# EasyEDA Pro project 作业3.eprj

# Schematic Schematic1
Board Name: Board1; Create Date: 2025-07-05; Page Name: P1; Project Name: 作业3; Schematic Name: Schematic1; Update Date: 2025-07-05; Company: 嘉立创EDA; Page Size: A4; Version: V1.0
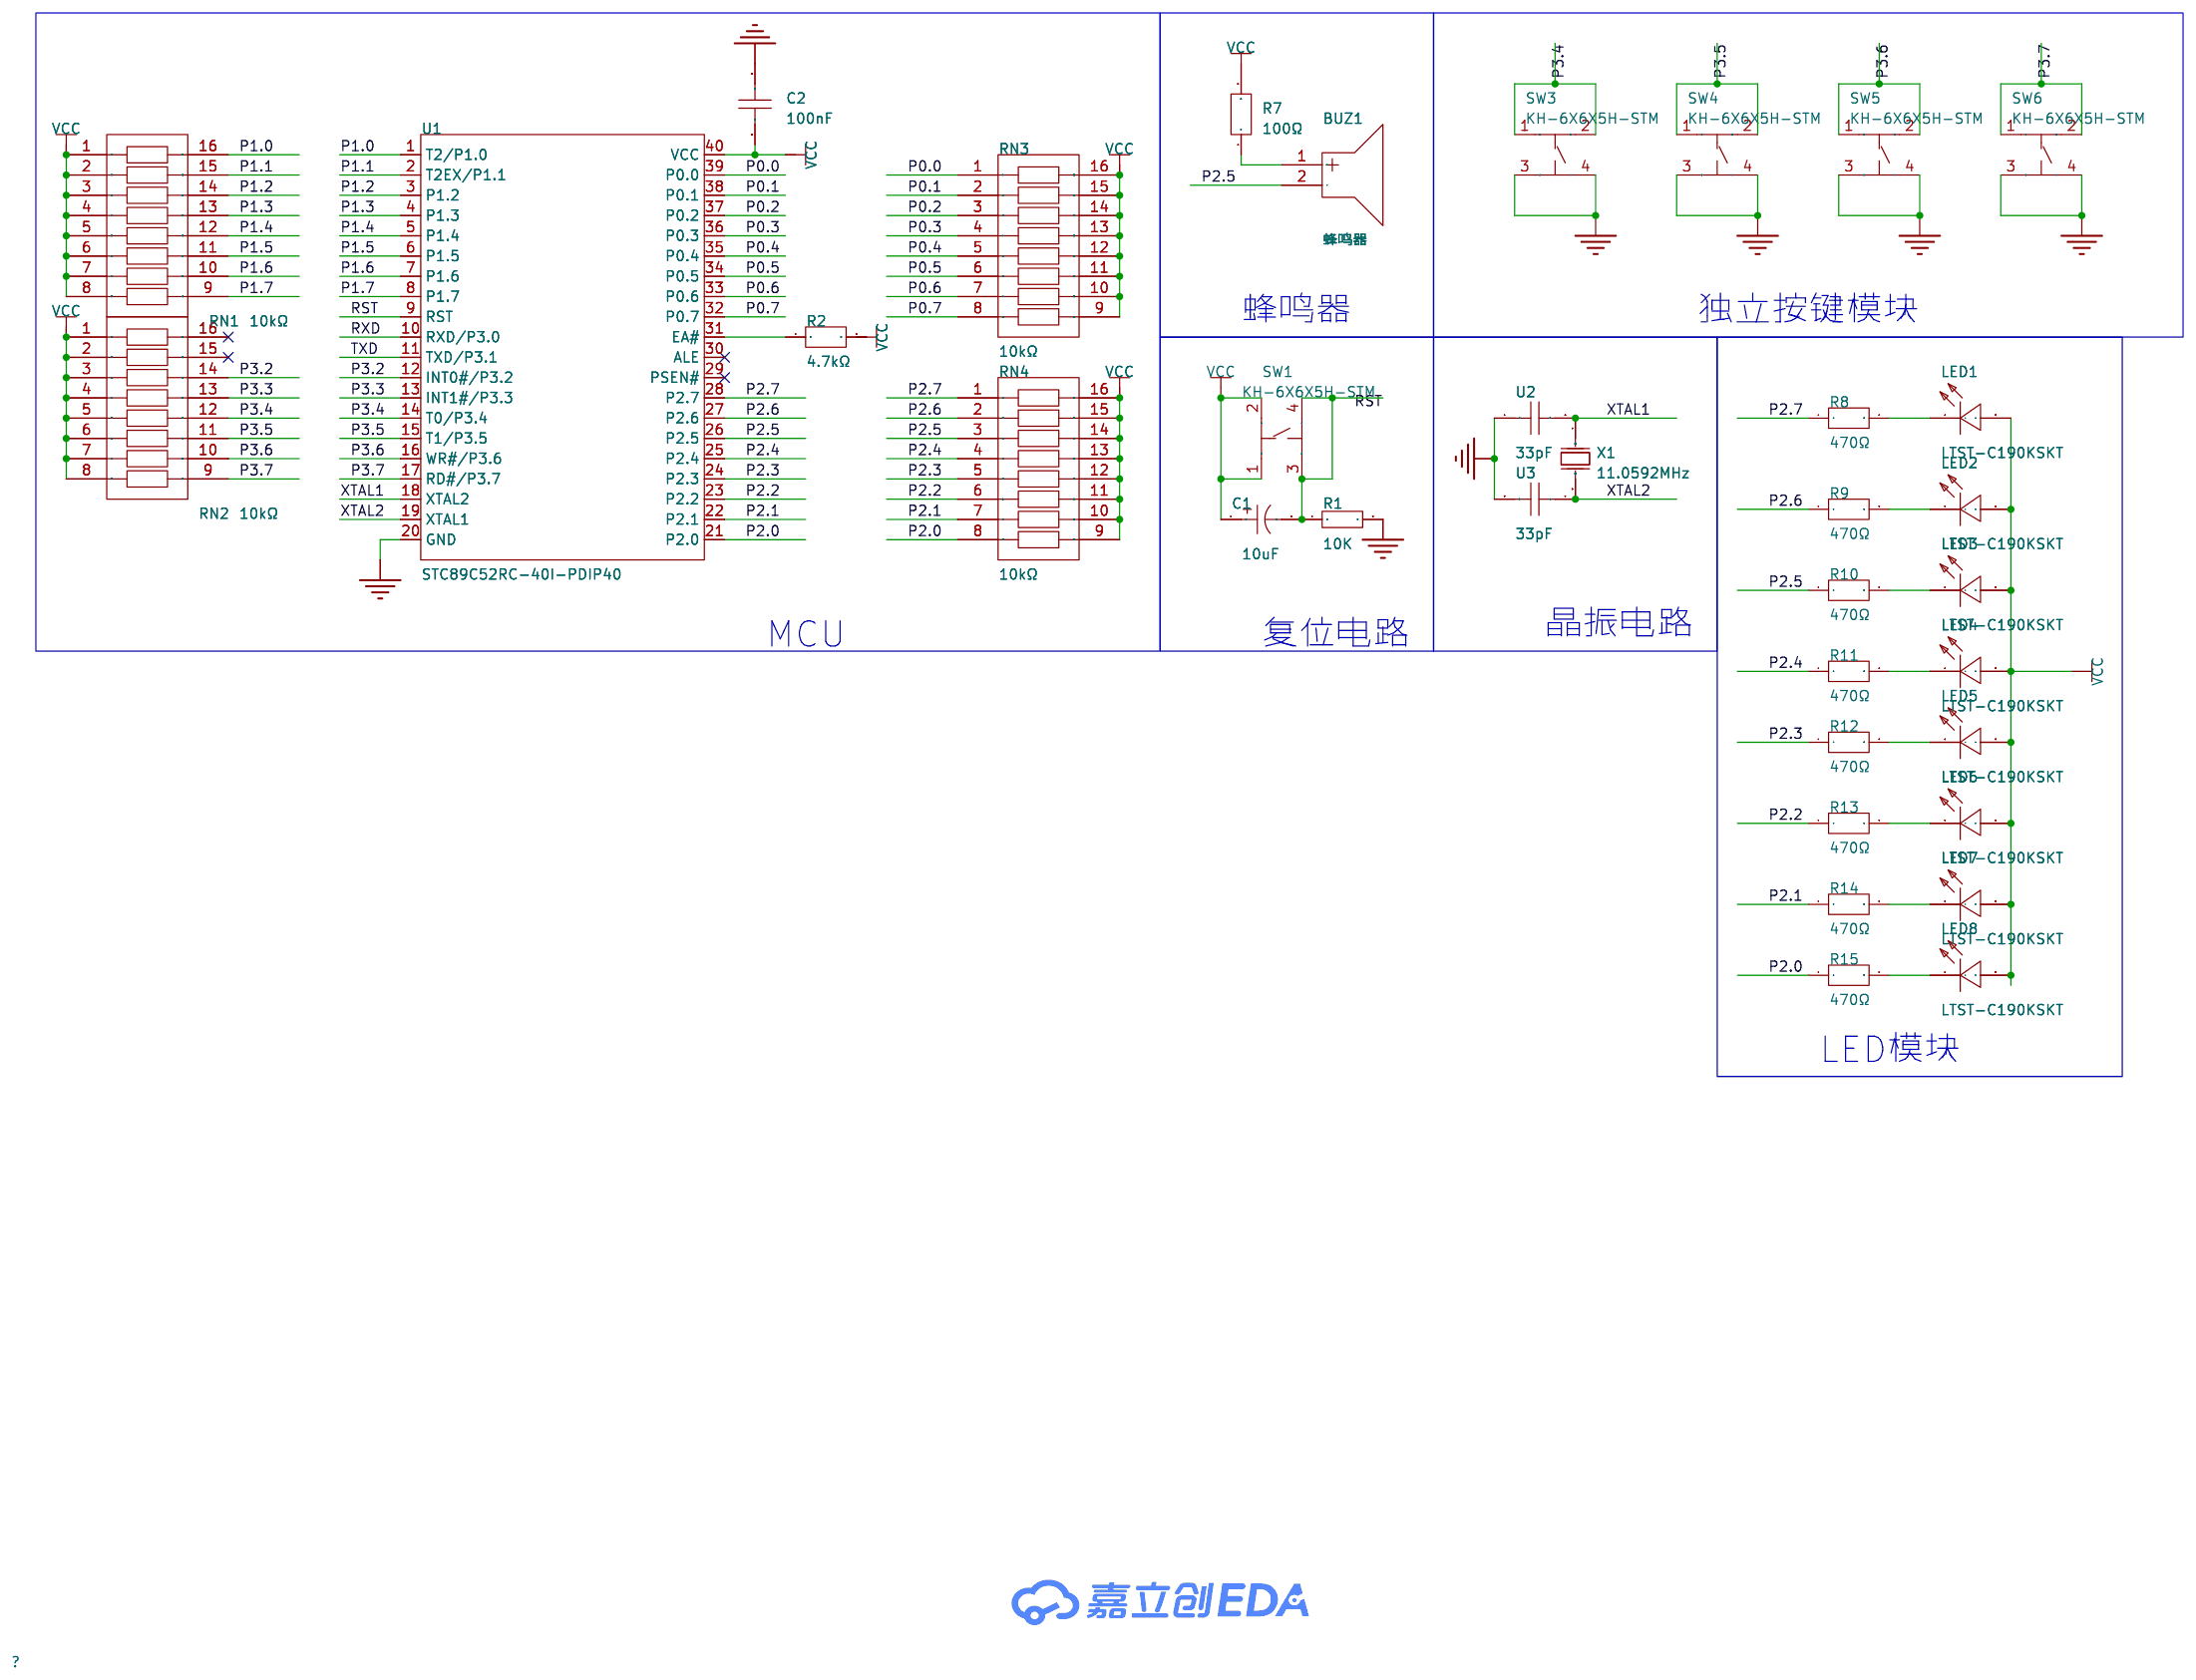
[diagram p0: schematic sheet]

## Parts
BUZ1  蜂鸣器  [BUZ-TH_BD9.0-P5.00-D0.6-FD]
C1  10uF  [CAP-TH_BD10.0-P5.00-D0.6-FD_1]
C2  100nF  [C0603]
LED1  LTST-C190KSKT  [LED0603-RD]
LED2  LTST-C190KSKT  [LED0603-RD]
LED3  LTST-C190KSKT  [LED0603-RD]
LED4  LTST-C190KSKT  [LED0603-RD]
LED5  LTST-C190KSKT  [LED0603-RD]
LED6  LTST-C190KSKT  [LED0603-RD]
LED7  LTST-C190KSKT  [LED0603-RD]
LED8  LTST-C190KSKT  [LED0603-RD]
R1  10K  [R0603]
R2  4.7kΩ  [R0805]
R7  100Ω  [R1206]
R8  470Ω  [R0402]
R9  470Ω  [R0402]
R10  470Ω  [R0402]
R11  470Ω  [R0402]
R12  470Ω  [R0402]
R13  470Ω  [R0402]
R14  470Ω  [R0402]
R15  470Ω  [R0402]
RN1  10kΩ  [DIP-16_L22.0-W6.7-P2.54-LS7.6-BL]
RN2  10kΩ  [DIP-16_L22.0-W6.7-P2.54-LS7.6-BL]
RN3  10kΩ  [DIP-16_L22.0-W6.7-P2.54-LS7.6-BL]
RN4  10kΩ  [DIP-16_L22.0-W6.7-P2.54-LS7.6-BL]
SW1  KH-6X6X5H-STM  [SW-SMD_4P-L6.0-W6.0-P4.50-LS9.0_H5.0]
SW3  KH-6X6X5H-STM  [SW-SMD_4P-L6.0-W6.0-P4.50-LS9.0_H5.0]
SW4  KH-6X6X5H-STM  [SW-SMD_4P-L6.0-W6.0-P4.50-LS9.0_H5.0]
SW5  KH-6X6X5H-STM  [SW-SMD_4P-L6.0-W6.0-P4.50-LS9.0_H5.0]
SW6  KH-6X6X5H-STM  [SW-SMD_4P-L6.0-W6.0-P4.50-LS9.0_H5.0]
U1  STC89C52RC-40I-PDIP40  [DIP-40_L52.0-W13.7-P2.54-LS15.2-BL]
U2  33pF  [C0603]
U3  33pF  [C0603]
X1  11.0592MHz  [HC-49US_L11.5-W4.5-P4.88]

## Library data of the parts
BUZ1 = 蜂鸣器: Supplier Part: C9900020875; Supplier Footprint: 插件; JLCPCB Part Class: 扩展库; Supplier: LCSC
C1 = CV100MPA16B: 容值:10uF;精度:±20%;额定电压:450V;纹波电流:200mA@100kHz;等效串联电阻(ESR):9Ω@100kHz;; LCSC Part Name: 10uF ±20% 450V; Supplier Part: C911241; Manufacturer: TWBOR(伯鸿); Supplier Footprint: 插件,D10xL16mm; JLCPCB Part Class: 扩展库; Datasheet: https://atta.szlcsc.com/upload/public/pdf/source/20201117/C911241_08C53D140102C9DE5D4425A5E1B3FE4F.pdf; Supplier: LCSC; Tolerance: ±20%; Voltage Rating: 450V; Ripple Current: 200mA@100kHz; Equivalent Series Resistance(ESR): 9Ω@100kHz; Pin Spacing: 5mm; Diameter: 10mm; Height - Seated (Max): 16mm; Lifetime: 5000hrs@105℃; Operating Temperature: -25℃~+105℃
C2 = 0603X7R104K250NT: 容值:100nF;精度:±10%;额定电压:25V;温度系数:X7R;; LCSC Part Name: 100nF ±10% 25V; Supplier Part: C48579280; Manufacturer: AIDE(爱迪电容); Supplier Footprint: 0603; JLCPCB Part Class: 扩展库; Datasheet: https://atta.szlcsc.com/upload/public/pdf/source/20210330/C2691711_5D01E1D4D7BF54205139C8425089DFE9.pdf; Supplier: LCSC; Tolerance: ±10%; Voltage Rating: 25V; Temperature Coefficient: X7R
LED1-LED8 = LTST-C190KSKT: 发光颜色:黄色;正向电压(VF):2.1V;功率:75mW;正向电流:20mA;主波长:584.5nm~597nm;二极管配置:-;透镜颜色:无色透明透镜;色温:-;发光强度:104mcd;发光角度:130°;载带方式:-;工作温度:-30℃~+85℃;; LCSC Part Name: 黄灯; Supplier Part: C125095; Manufacturer: LITEON(光宝); Supplier Footprint: 0603; JLCPCB Part Class: 扩展库; Datasheet: https://atta.szlcsc.com/upload/public/pdf/source/20180129/C125095_15171881843821315881.pdf; Supplier: LCSC; Emitted Color: 黄色; Forward Voltage (VF): 2.1V; Power Dissipation: 75mW; Forward Current: 20mA; Dominant Wavelength: 584.5nm~597nm; Peak Wavelength: 588nm; Lens Color: 无色透明透镜; Luminous Intensity: 104mcd; Viewing Angle: 130°; Operating Temperature: -30℃~+85℃
R1 = Res_0603: Supplier Footprint: 0603
R2 = ERJ-U06F4701V: 电阻类型:厚膜电阻;阻值:4.7kΩ;精度:±1%;功率:125mW;工作电压:-;温度系数:±100ppm/℃;; LCSC Part Name: 4.7kΩ ±1% 125mW 厚膜电阻; Supplier Part: C1859462; Manufacturer: PANASONIC(松下); Supplier Footprint: 0805; JLCPCB Part Class: 扩展库; Datasheet: https://atta.szlcsc.com/upload/public/pdf/source/20210624/C1859462_0DC8A541405FCF91B34CFE3F505433C6.pdf; Supplier: LCSC; Type: 厚膜电阻; Tolerance: ±1%; Power(Watts): 125mW; Temperature Coefficient: ±100ppm/℃; Operating Temperature: -55℃~+155℃
R7 = CQ06W4J0101T5E: 电阻类型:-;阻值:100Ω;精度:±5%;功率:250mW;工作电压:200V;; LCSC Part Name: 100Ω ±5% 250mW; Supplier Part: C2765667; Manufacturer: UNI-ROYAL(厚声); Supplier Footprint: 1206; JLCPCB Part Class: 扩展库; Datasheet: https://atta.szlcsc.com/upload/public/pdf/source/20210330/C2758625_90D19EEA9B8C23AA9BAF71D52BD1DB3E.pdf; Supplier: LCSC; Tolerance: ±5%; Power(Watts): 250mW; Voltage-Supply(Max): 200V; Operating Temperature: -55℃~+155℃
R8-R15 = FRC0402F4700TS: 电阻类型:厚膜电阻;阻值:470Ω;精度:±1%;功率:62.5mW;工作电压:50V;温度系数:±100ppm/℃;; LCSC Part Name: 470Ω ±1% 62.5mW 厚膜电阻; Supplier Part: C2909361; Manufacturer: FOJAN(富捷); Supplier Footprint: 0402; JLCPCB Part Class: 扩展库; Datasheet: https://atta.szlcsc.com/upload/public/pdf/source/20211221/925EC7D7225764EE0046F22065062C87.pdf; Supplier: LCSC; Type: 厚膜电阻; Tolerance: ±1%; Power(Watts): 62.5mW; Voltage-Supply(Max): 50V; Temperature Coefficient: ±100ppm/℃; Operating Temperature: -55℃~+155℃
RN1-RN4 = 4116R-1-103LF: 电阻器数:8;阻值:10kΩ;精度:±2%;单个元件功率:250mW;温度系数:±100ppm/℃;; LCSC Part Name: 10kΩ ±2%; Supplier Part: C6087381; Manufacturer: BOURNS; Supplier Footprint: DIP-16; Datasheet: https://atta.szlcsc.com/upload/public/pdf/source/20210630/3D9C012B231BA1D1C9C6139B97130D1A.pdf; Supplier: LCSC; Number of Resistors: 8; Tolerance: ±2%; Power(Watts): 250mW; Temperature Coefficient: ±100ppm/℃; Number of Pins: 16
SW1 SW3-SW6 = KH-6X6X5H-STM: 电路结构:单刀单掷;按钮形状:圆形按钮;安装方式:立贴;开关长度:6mm;开关宽度:6mm;开关高度:5mm;带支架:不带;触点电流:50mA;额定电压(DC):12V;机械寿命:8万次;; LCSC Part Name: 6*6*5mm 立贴 轻触开关; Supplier Part: C2837531; Manufacturer: kinghelm(金航标); Supplier Footprint: SMD; JLCPCB Part Class: 扩展库; Datasheet: https://atta.szlcsc.com/upload/public/pdf/source/20210608/C2837531_45E87AB996CE723B09405FF2EA209C4C.pdf; Supplier: LCSC; Circuit: 单刀单掷; Actuator Style: 圆形按钮; Mounting Style: 立贴; Switch Length: 6mm; Switch Width: 6mm; Switch Height: 5mm; Strike Gundam: 不带; Contact Current: 50mA; Voltage Rating (DC): 12V; Actuator/Cap Color: 黑色; Pin Style: 鸥翼型; Mechanical Life: 8万次
U1 = STC89C52RC-40I-PDIP40: CPU内核:51系列;应用领域:-;; Supplier Part: C14022; Manufacturer: STC; Supplier Footprint: DIP-40; JLCPCB Part Class: 扩展库; Datasheet: https://atta.szlcsc.com/upload/public/pdf/source/20250219/C2F0DDDE7C5E9ADA5B33742D18630F09.pdf; Supplier: LCSC; CPU Core: 51系列; Program Storage Size: 8KB; Program Memory Type: FLASH; Number of I/O: 35; Voltage - Supply: 3.3V~5.5V
U2 U3 = GRM1885C1H330FA01D: 容值:33pF;精度:±1%;额定电压:50V;温度系数:-;; LCSC Part Name: 33pF ±1% 50V; Supplier Part: C882522; Manufacturer: muRata(村田); Supplier Footprint: 0603; JLCPCB Part Class: 扩展库; Datasheet: https://atta.szlcsc.com/upload/public/pdf/source/20200305/C490387_23319AE8C154DEB24C505E6C82A8106A.pdf; Supplier: LCSC; Tolerance: ±1%; Voltage Rating: 50V
X1 = X49SD110592MSD2SC: 晶振类型:直插晶振;频率:11.0592MHz;常温频差:±20ppm;负载电容:20pF;频率稳定度:±30ppm;; LCSC Part Name: HC-49US 11.0592MHZ 2P 49S 20PF ±20PPM -20~70℃（±30PPM）; Supplier Part: C2203; Manufacturer: YXC(扬兴晶振); Supplier Footprint: HC-49S; JLCPCB Part Class: 扩展库; Datasheet: https://atta.szlcsc.com/upload/public/pdf/source/20240329/977D7F2434F98B2BE33270BB9FF3D86D.pdf; Supplier: LCSC; Type: 直插晶振; Normal temperature Frequency Tolerance: ±20ppm; Load Capacitance: 20pF; Frequency Stability: ±30ppm; Operating Temperature: -20℃~+70℃

## Nets
GND: C2.2 R1.2 SW3.3 SW3.4 SW4.3 SW4.4 SW5.3 SW5.4 SW6.3 SW6.4 U1.20(GND) U2.1 U3.2
VCC: C1.1 C2.1 LED1.2(+) LED2.2(+) LED3.2(+) LED4.2(+) LED5.2(+) LED6.2(+) LED7.2(+) LED8.2(+) R2.2 R7.2 RN1.1 RN1.2 RN1.3 RN1.4 RN1.5 RN1.6 RN1.7 RN1.8 RN2.1 RN2.2 RN2.3 RN2.4 RN2.5 RN2.6 RN2.7 RN2.8 RN3.9 RN3.10 RN3.11 RN3.12 RN3.13 RN3.14 RN3.15 RN3.16 RN4.9 RN4.10 RN4.11 RN4.12 RN4.13 RN4.14 RN4.15 RN4.16 SW1.1 SW1.2 U1.40(VCC)
P0.0: RN3.1 U1.39(P0.0)
P0.1: RN3.2 U1.38(P0.1)
P0.2: RN3.3 U1.37(P0.2)
P0.3: RN3.4 U1.36(P0.3)
P0.4: RN3.5 U1.35(P0.4)
P0.5: RN3.6 U1.34(P0.5)
P0.6: RN3.7 U1.33(P0.6)
P0.7: RN3.8 U1.32(P0.7)
P1.0: RN1.16 U1.1(T2/P1.0)
P1.1: RN1.15 U1.2(T2EX/P1.1)
P1.2: RN1.14 U1.3(P1.2)
P1.3: RN1.13 U1.4(P1.3)
P1.4: RN1.12 U1.5(P1.4)
P1.5: RN1.11 U1.6(P1.5)
P1.6: RN1.10 U1.7(P1.6)
P1.7: RN1.9 U1.8(P1.7)
P2.0: R15.1 RN4.8 U1.21(P2.0)
P2.1: R14.1 RN4.7 U1.22(P2.1)
P2.2: R13.1 RN4.6 U1.23(P2.2)
P2.3: R12.1 RN4.5 U1.24(P2.3)
P2.4: R11.1 RN4.4 U1.25(P2.4)
P2.5: BUZ1.2(-) R10.1 RN4.3 U1.26(P2.5)
P2.6: R9.1 RN4.2 U1.27(P2.6)
P2.7: R8.1 RN4.1 U1.28(P2.7)
P3.2: RN2.14 U1.12(INT0#/P3.2)
P3.3: RN2.13 U1.13(INT1#/P3.3)
P3.4: RN2.12 SW3.1 SW3.2 U1.14(T0/P3.4)
P3.5: RN2.11 SW4.1 SW4.2 U1.15(T1/P3.5)
P3.6: RN2.10 SW5.1 SW5.2 U1.16(WR#/P3.6)
P3.7: RN2.9 SW6.1 SW6.2 U1.17(RD#/P3.7)
RST: C1.2 R1.1 SW1.3 SW1.4 U1.9(RST)
RXD: U1.10(RXD/P3.0)
TXD: U1.11(TXD/P3.1)
XTAL1: U1.18(XTAL2) U2.2 X1.1(OSC1)
XTAL2: U1.19(XTAL1) U3.1 X1.2(OSC2)
$1N1280: R2.1 U1.31(EA#)
$1N1412: BUZ1.1(+) R7.1
$1N2105: LED1.1(-) R8.2
$1N2106: LED2.1(-) R9.2
$1N2107: LED3.1(-) R10.2
$1N2108: LED4.1(-) R11.2
$1N2109: LED5.1(-) R12.2
$1N2110: LED6.1(-) R13.2
$1N2111: LED7.1(-) R14.2
$1N2112: LED8.1(-) R15.2

Not connected (* = marked no-connect by the designer): RN2 15* 16*; U1 29(PSEN#)* 30(ALE)*

## Notes on the sheet
- 蜂鸣器
- 独立按键模块
- 晶振电路
- MCU
- 复位电路
- LED模块

# Board PCB1
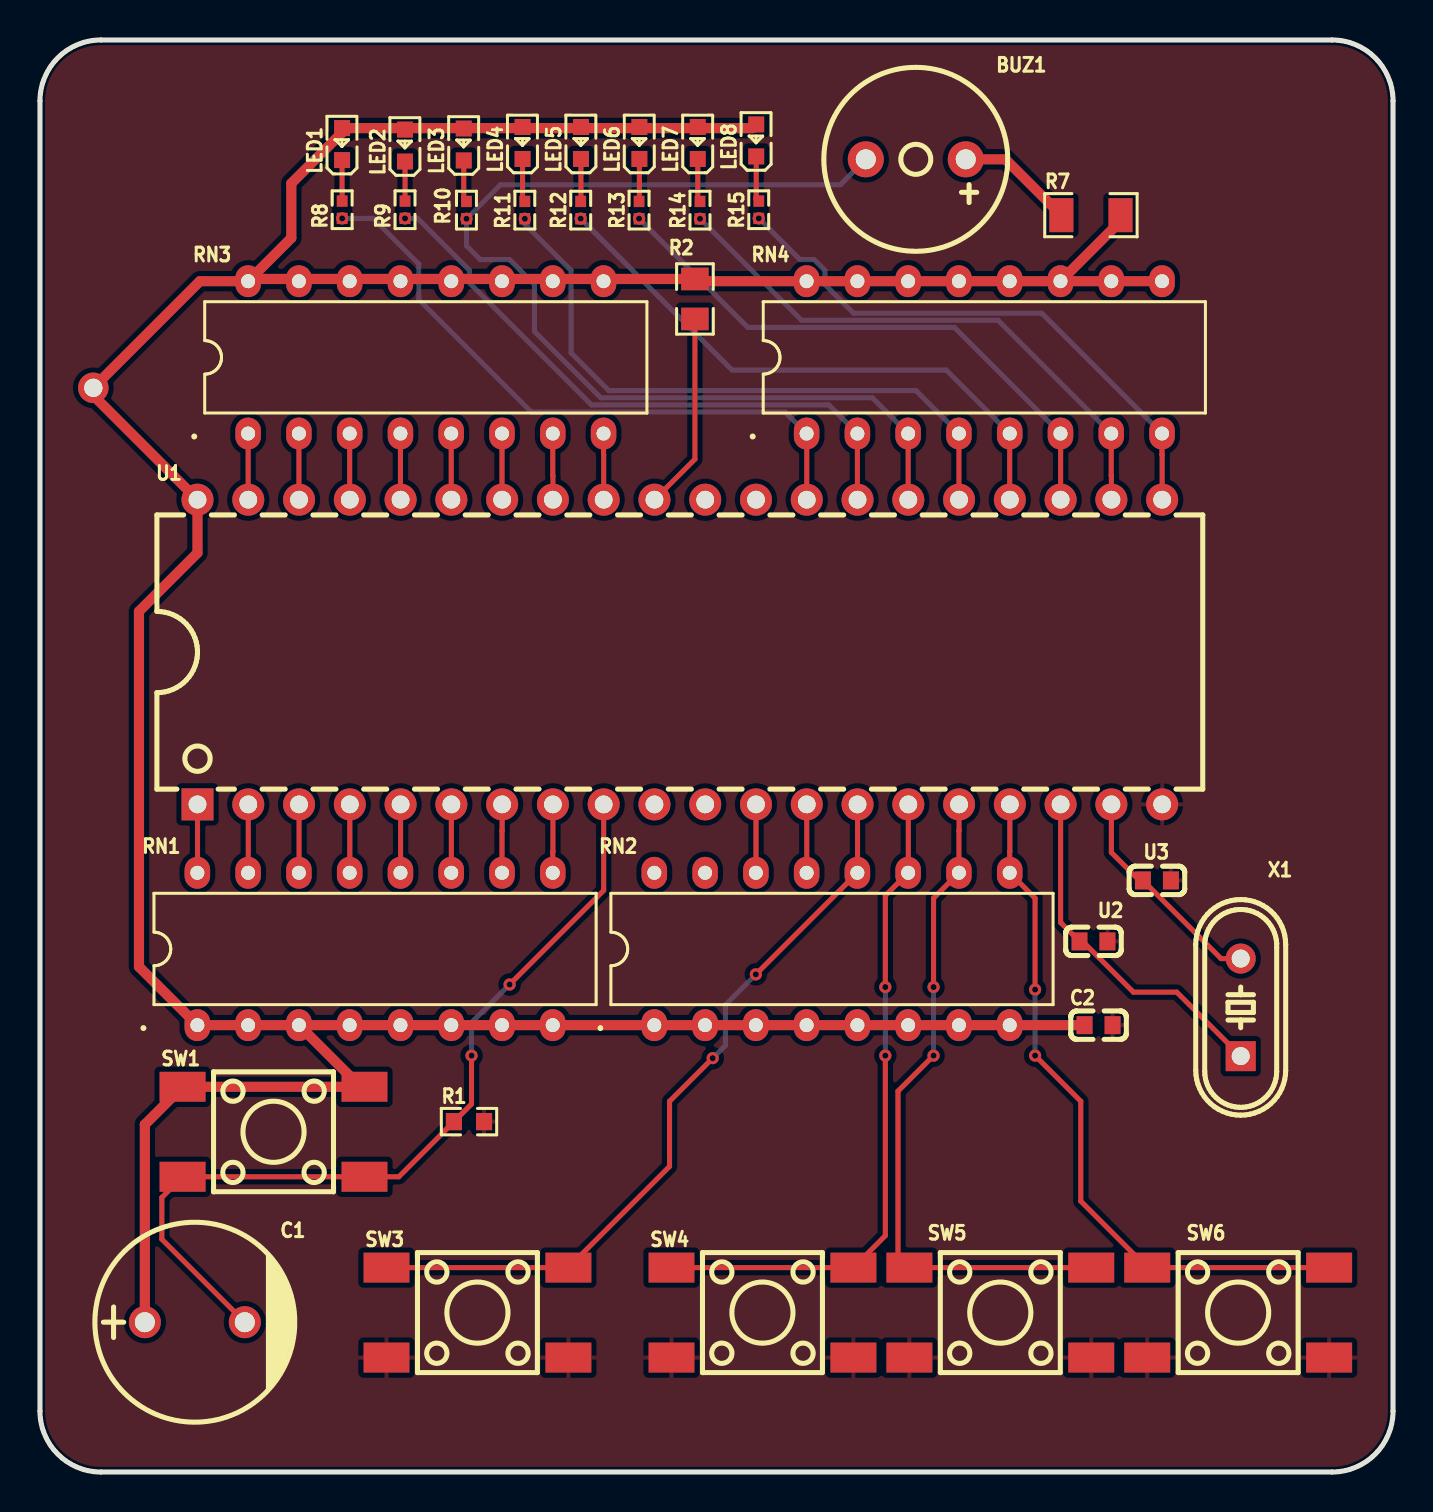
[diagram p1: board, top side]
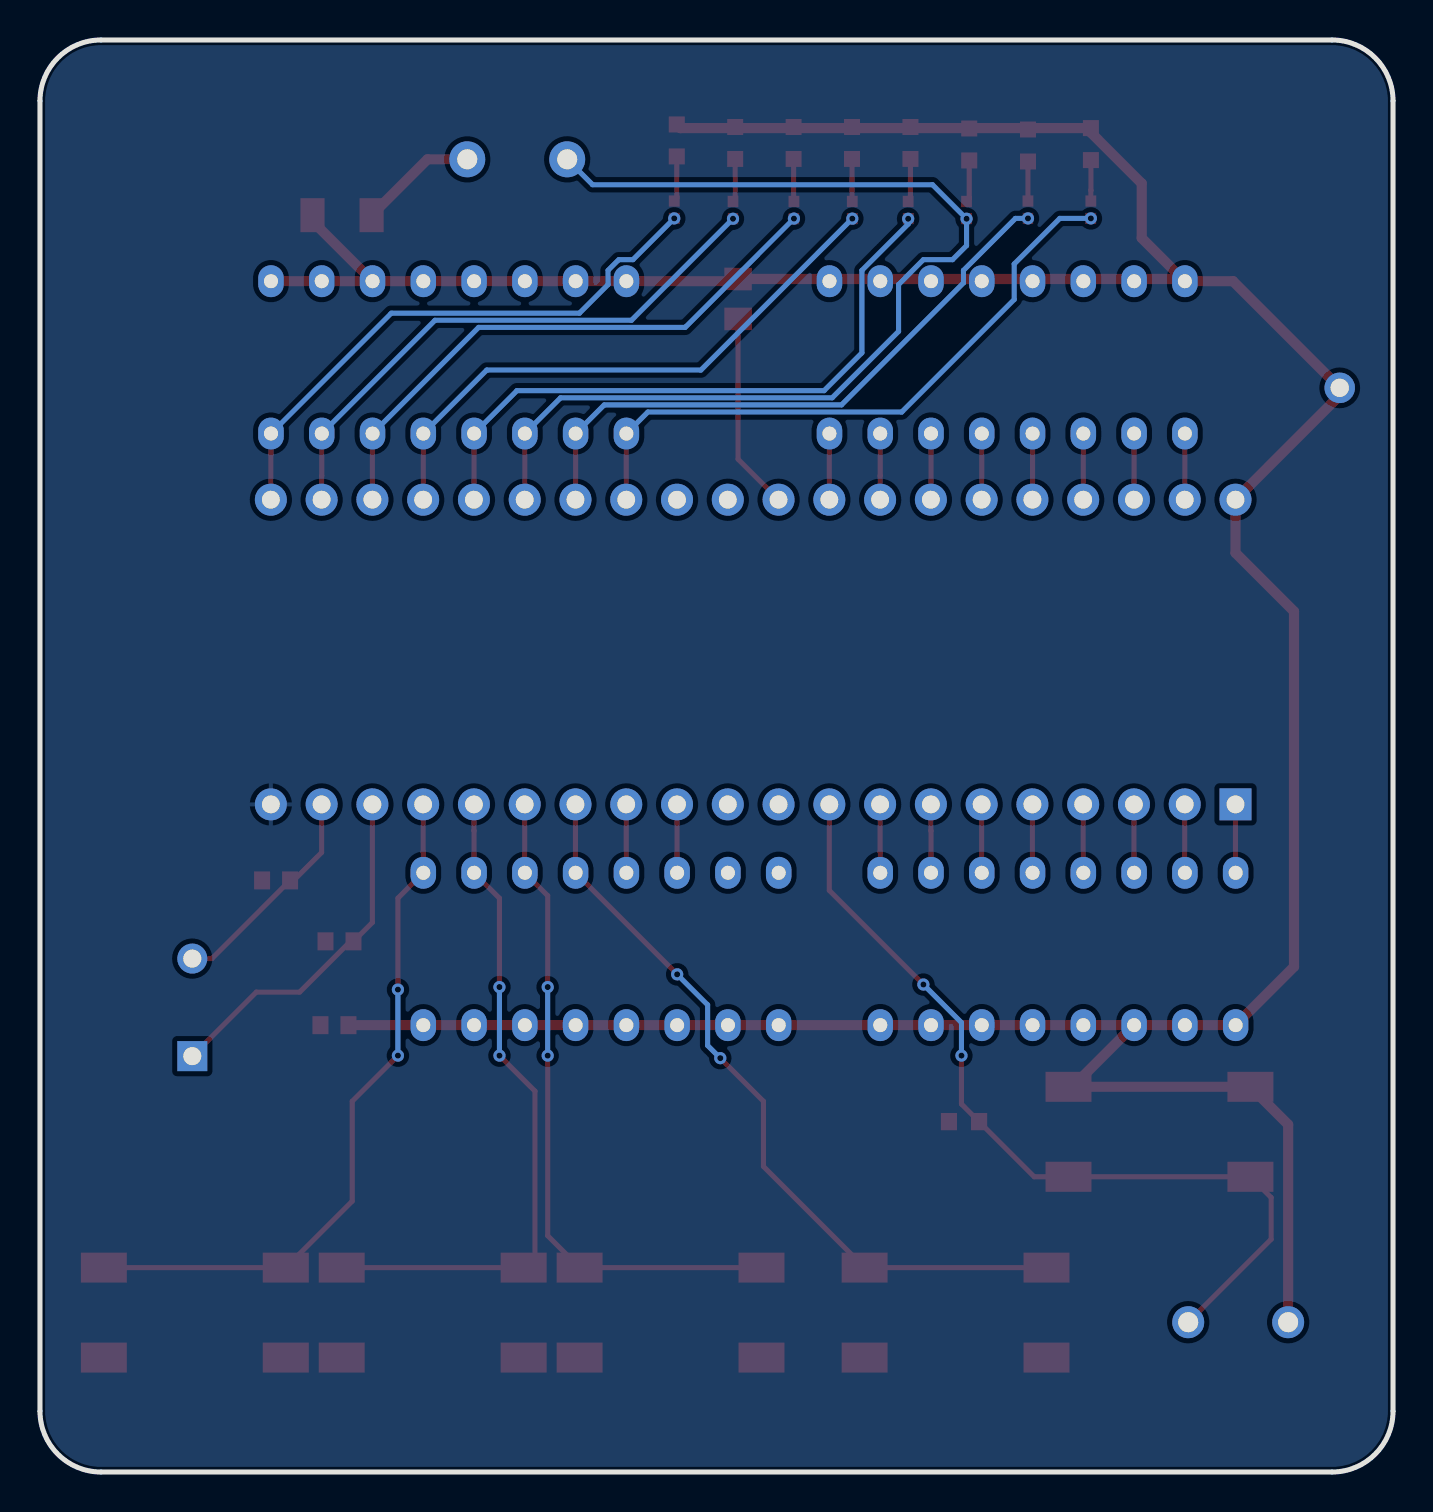
[diagram p2: board, bottom side, seen from below]

Outline 67.69 x 71.63 mm; copper layers: Top Layer, Bottom Layer. Coordinates in mm from the lower left corner of the outline.
Outline path: 0,68.58 0,3.05 arc(0.89,0.89) 3.05,0 64.64,0 arc(66.8,0.89) 67.69,3.05 67.69,68.58 arc(66.8,70.74) 64.64,71.63 3.05,71.63 arc(0.89,70.74) 0,68.58
Stack: Top Layer 0.035mm / Dielectric1 1.51mm FR4 er 4.5 / Bottom Layer 0.035mm

## Design rules (mm)
template: JLCPCB Capability(Two Layers Board)
spacing copperThickness1oz (default): track to track 0.102, other pairs 0.152 to 0.3
spacing copperThickness2oz: track to track 0.203, other pairs 0.152 to 0.3
track width copperThickness1oz (default): min 0.127, default 0.254, max 2.54
track width copperThickness2oz: min 0.203, default 0.254, max 2.54
differential pair differentialPair (default): width min 0.127, default 0.254, max 2.54; gap min 0.152, default 0.152
via viaSize (default): diameter min 0.5, default 0.61, max 10; hole min 0.3, default 0.305, max 6.3

## Placement (name value [footprint] x y rotation side)
BUZ1  蜂鸣器  [BUZ-TH_BD9.0-P5.00-D0.6-FD]  43.81 65.66 180 top
C1  10uF  [CAP-TH_BD10.0-P5.00-D0.6-FD_1]  7.75 7.49 0 top
C2  100nF  [C0603]  52.96 22.35 0 top
LED1  LTST-C190KSKT  [LED0603-RD]  15.11 66.42 90 top
LED2  LTST-C190KSKT  [LED0603-RD]  18.26 66.35 90 top
LED3  LTST-C190KSKT  [LED0603-RD]  21.2 66.4 90 top
LED4  LTST-C190KSKT  [LED0603-RD]  24.14 66.48 90 top
LED5  LTST-C190KSKT  [LED0603-RD]  27.07 66.48 90 top
LED6  LTST-C190KSKT  [LED0603-RD]  29.99 66.48 90 top
LED7  LTST-C190KSKT  [LED0603-RD]  32.91 66.48 90 top
LED8  LTST-C190KSKT  [LED0603-RD]  35.83 66.6 90 top
NOREF  -  [Pad_e35]  2.67 54.23 0 top
R1  10K  [R0603]  21.46 17.53 0 top
R2  4.7kΩ  [R0805]  32.77 58.67 90 top
R7  100Ω  [R1206]  52.58 62.86 0 top
R8  470Ω  [R0402]  15.12 63.14 90 top
R9  470Ω  [R0402]  18.26 63.14 90 top
R10  470Ω  [R0402]  21.34 63.12 90 top
R11  470Ω  [R0402]  24.26 63.12 90 top
R12  470Ω  [R0402]  27.05 63.12 90 top
R13  470Ω  [R0402]  29.97 63.12 90 top
R14  470Ω  [R0402]  33.02 63.12 90 top
R15  470Ω  [R0402]  35.96 63.14 90 top
RN1  10kΩ  [DIP-16_L22.0-W6.7-P2.54-LS7.6-BL]  16.76 26.16 0 top
RN2  10kΩ  [DIP-16_L22.0-W6.7-P2.54-LS7.6-BL]  39.62 26.16 0 top
RN3  10kΩ  [DIP-16_L22.0-W6.7-P2.54-LS7.6-BL]  19.3 55.75 0 top
RN4  10kΩ  [DIP-16_L22.0-W6.7-P2.54-LS7.6-BL]  47.24 55.75 0 top
SW1  KH-6X6X5H-STM  [SW-SMD_4P-L6.0-W6.0-P4.50-LS9.0_H5.0]  11.68 17.02 0 top
SW3  KH-6X6X5H-STM  [SW-SMD_4P-L6.0-W6.0-P4.50-LS9.0_H5.0]  21.89 7.97 0 top
SW4  KH-6X6X5H-STM  [SW-SMD_4P-L6.0-W6.0-P4.50-LS9.0_H5.0]  36.14 7.97 0 top
SW5  KH-6X6X5H-STM  [SW-SMD_4P-L6.0-W6.0-P4.50-LS9.0_H5.0]  48.04 7.97 0 top
SW6  KH-6X6X5H-STM  [SW-SMD_4P-L6.0-W6.0-P4.50-LS9.0_H5.0]  59.94 7.97 0 top
U1  STC89C52RC-40I-PDIP40  [DIP-40_L52.0-W13.7-P2.54-LS15.2-BL]  32.01 41.01 0 top
U2  33pF  [C0603]  52.7 26.54 180 top
U3  33pF  [C0603]  55.88 29.59 0 top
X1  11.0592MHz  [HC-49US_L11.5-W4.5-P4.88]  60.07 23.24 90 top

## Footprints (pads in the part's own frame, mm; a bottom-side part is the same pattern mirrored in y, then rotated)
BUZ-TH_BD9.0-P5.00-D0.6-FD
  round 1.8 hole 1: 1(-2.5,0) 2(2.5,0)
C0603
  rect 0.8x0.9 smd: 1(-0.7,0) 2(0.7,0)
CAP-TH_BD10.0-P5.00-D0.6-FD_1
  round 1.6 hole 1: 1(-2.5,0) 2(2.5,0)
DIP-16_L22.0-W6.7-P2.54-LS7.6-BL
  oval 1.276x1.595 hole 0.7: 1(-8.89,-3.81) 2(-6.35,-3.81) 3(-3.81,-3.81) 4(-1.27,-3.81) 5(1.27,-3.81) 6(3.81,-3.81) 7(6.35,-3.81) 8(8.89,-3.81) 9(8.89,3.81) 10(6.35,3.81) 11(3.81,3.81) 12(1.27,3.81) 13(-1.27,3.81) 14(-3.81,3.81) 15(-6.35,3.81) 16(-8.89,3.81)
DIP-40_L52.0-W13.7-P2.54-LS15.2-BL
  rect 1.6x1.6 hole 0.889: 1(-24.13,-7.62)
  round 1.6 hole 0.889: 2(-21.59,-7.62) 3(-19.05,-7.62) 4(-16.51,-7.62) 5(-13.97,-7.62) 6(-11.43,-7.62) 7(-8.89,-7.62) 8(-6.35,-7.62) 9(-3.81,-7.62) 10(-1.27,-7.62) 11(1.27,-7.62) 12(3.81,-7.62) 13(6.35,-7.62) 14(8.89,-7.62) 15(11.43,-7.62) 16(13.97,-7.62) 17(16.51,-7.62) 18(19.05,-7.62) 19(21.59,-7.62) 20(24.13,-7.62) 21(24.13,7.62) 22(21.59,7.62) 23(19.05,7.62) 24(16.51,7.62) 25(13.97,7.62) 26(11.43,7.62) 27(8.89,7.62) 28(6.35,7.62) 29(3.81,7.62) 30(1.27,7.62) 31(-1.27,7.62) 32(-3.81,7.62) 33(-6.35,7.62) 34(-8.89,7.62) 35(-11.43,7.62) 36(-13.97,7.62) 37(-16.51,7.62) 38(-19.05,7.62) 39(-21.59,7.62) 40(-24.13,7.62)
HC-49US_L11.5-W4.5-P4.88
  rect 1.5x1.5 hole 0.9: 1(-2.44,0)
  round 1.5 hole 0.9: 2(2.44,0)
LED0603-RD
  rect 0.8x0.8 smd: 1(-0.799,0) 2(0.799,0)
Pad_e35
  round 1.524 hole 0.914: 1(0,0)
R0402
  rect 0.566x0.54 smd: 1(-0.433,0) 2(0.433,0)
R0603
  rect 0.806x0.864 smd: 1(-0.753,0) 2(0.753,0)
R0805
  rect 1.133x1.377 smd: 1(-1,0) 2(1,0)
R1206
  rect 1.208x1.701 smd: 1(-1.479,0) 2(1.479,0)
SW-SMD_4P-L6.0-W6.0-P4.50-LS9.0_H5.0
  rect 2.3x1.5 smd: 1(-4.55,2.25) 2(4.55,2.25) 3(-4.55,-2.25) 4(4.55,-2.25)

## Nets
As in the schematic, except:
VCC: C1.1 C2.1 LED1.2 LED2.2 LED3.2 LED4.2 LED5.2 LED6.2 LED7.2 LED8.2 NOREF.1 R2.2 R7.2 RN1.1 RN1.2 RN1.3 RN1.4 RN1.5 RN1.6 RN1.7 RN1.8 RN2.1 RN2.2 RN2.3 RN2.4 RN2.5 RN2.6 RN2.7 RN2.8 RN3.9 RN3.10 RN3.11 RN3.12 RN3.13 RN3.14 RN3.15 RN3.16 RN4.9 RN4.10 RN4.11 RN4.12 RN4.13 RN4.14 RN4.15 RN4.16 SW1.1 SW1.2 U1.40

Pads without a net: RN2 15 16; U1 29 30

## Via types
v1: diameter 0.61, hole 0.305, Top Layer to Bottom Layer, 18 vias

## Routing (per net, layer and track width the routed paths; a pad name or vN(x,y) marks a point on that pad's centre or on a via; arc(x,y) is an arc through that point)
VCC: length 197.3
  Top Layer w0.508: 16.04,19.27 16.23,19.27 ; 16.04,19.27 7.13,19.27 5.25,17.38 C1.1 ; 16.04,19.27 RN1.3 ; RN4.11 RN4.10 56.13,59.56 ; RN4.11 RN4.12 RN4.14 RN4.15 RN4.16 32.88,59.56 R2.2 10.52,59.67 12.57,61.72 12.57,64.46 15.11,67 LED1.2 35.65,67.22 LED8.2 ; RN4.11 54.06,62.57 R7.2 ; RN1.3 RN1.4 RN1.5 RN1.6 RN1.7 RN1.8 RN2.1 RN2.2 RN2.5 RN2.6 C2.1 ; RN1.3 RN1.2 RN1.1 4.95,25.27 4.95,43.05 7.88,45.97 U1.40 2.67,53.85 NOREF.1 8,59.56 RN3.16
P0.0: length 3.3
  Top Layer w0.254: RN3.1 10.41,48.64 U1.39
P0.1: length 3.3
  Top Layer w0.254: RN3.2 12.95,48.64 U1.38
P0.2: length 3.3
  Top Layer w0.254: RN3.3 15.49,48.64 U1.37
P0.3: length 3.3
  Top Layer w0.254: 18.03,51.94 18.03,48.64 U1.36
P0.4: length 3.3
  Top Layer w0.254: U1.35 20.57,48.64 RN3.5
P0.5: length 3.3
  Top Layer w0.254: RN3.6 23.11,48.79 23.12,48.78 U1.34
P0.6: length 3.3
  Top Layer w0.254: U1.33 25.66,49.83 25.65,49.84 RN3.7
P0.7: length 3.3
  Top Layer w0.254: 28.19,51.94 28.19,50.89 28.2,50.88 U1.32
P1.0: length 3.4
  Top Layer w0.254: RN1.16 7.88,29.98 U1.1
P1.1: length 3.4
  Top Layer w0.254: RN1.15 10.42,29.98 U1.2
P1.2: length 3.4
  Top Layer w0.254: RN1.14 12.96,29.98 U1.3
P1.3: length 3.4
  Top Layer w0.254: RN1.13 15.5,29.98 U1.4
P1.4: length 3.4
  Top Layer w0.254: U1.5 18.04,29.98 RN1.12
P1.5: length 3.4
  Top Layer w0.254: U1.6 20.58,29.98 RN1.11
P1.6: length 3.4
  Top Layer w0.254: RN1.10 23.11,32.08 23.12,32.08 U1.7
P1.7: length 3.4
  Top Layer w0.254: U1.8 25.66,31.03 25.65,31.02 RN1.9
P2.0: length 28.4
  Top Layer w0.254: 56.13,51.94 56.13,50.89 56.14,50.88 U1.21
  Bottom Layer w0.254: 56.13,51.94 50.11,57.96 40.7,57.96 39.27,59.39 39.27,60.1 38.73,60.64 38.02,60.64 v1(35.96,62.7)
P2.1: length 28.3
  Top Layer w0.254: U1.22 53.6,49.83 53.59,49.84 RN4.7
  Bottom Layer w0.254: RN4.7 47.93,57.61 38.1,57.61 v1(33.02,62.69)
P2.2: length 28.8
  Top Layer w0.254: U1.23 51.06,51.94 RN4.6
  Bottom Layer w0.254: RN4.6 45.74,57.25 35.41,57.25 v1(29.97,62.69)
P2.3: length 29.2
  Top Layer w0.254: U1.24 48.51,48.64 RN4.5
  Bottom Layer w0.254: v1(27.05,62.69) 34.63,55.12 45.34,55.12 RN4.5
P2.4: length 32.1
  Top Layer w0.254: U1.25 45.97,48.64 45.97,51.94
  Bottom Layer w0.254: 45.97,51.94 43.83,54.09 28.46,54.09 26.57,55.98 26.57,60.1 24.26,62.42 v1(24.26,62.69)
P2.5: length 53.2
  Top Layer w0.254: U1.26 43.43,48.64 RN4.3
  Bottom Layer w0.254: RN4.3 41.65,53.73 28.06,53.73 24.74,57.05 24.74,59.4 23.49,60.64 22.04,60.64 21.34,61.34 v1(21.34,62.69) 23.04,64.39 40.05,64.39 BUZ1.2
P2.6: length 30.8
  Top Layer w0.254: U1.27 40.89,48.64 RN4.2
  Bottom Layer w0.254: v1(18.26,62.7) 18.89,62.7 21.49,60.1 21.49,59.48 27.59,53.38 39.46,53.38 RN4.2
P2.7: length 32
  Top Layer w0.254: RN4.1 38.36,51.94 U1.28
  Bottom Layer w0.254: RN4.1 37.28,53.02 24.58,53.02 18.95,58.65 18.95,60.42 16.67,62.7 v1(15.12,62.7)
P3.2: length 3.4
  Top Layer w0.254: U1.12 35.82,29.98 35.81,29.97
P3.3: length 3.4
  Top Layer w0.254: U1.13 38.36,29.98 38.35,29.97
P3.4: length 38.3
  Top Layer w0.254: U1.14 40.9,29.98 RN2.12 v1(35.81,24.89) ; SW3.1 SW3.2 31.5,15.28 31.5,18.54 v1(33.65,20.7)
  Bottom Layer w0.254: v1(33.65,20.7) 34.29,21.34 34.29,23.37 v1(35.81,24.89)
P3.5: length 33.4
  Top Layer w0.254: U1.15 43.44,29.98 RN2.11 42.29,28.83 v1(42.29,24.26) ; v1(42.29,20.83) 42.29,11.82 SW4.2 SW4.1
  Bottom Layer w0.254: v1(42.29,24.26) v1(42.29,20.83)
P3.6: length 33.8
  Top Layer w0.254: 43.49,10.29 42.93,10.86 42.93,19.05 v1(44.7,20.83) ; 43.49,10.29 43.56,10.29 43.63,10.22 52.59,10.22 ; 43.49,10.29 SW5.1 ; v1(44.7,24.26) 44.7,28.7 45.97,29.97 45.97,32.08 45.98,32.08 U1.16
  Bottom Layer w0.254: v1(44.7,24.26) v1(44.7,20.83)
P3.7: length 35.1
  Top Layer w0.254: 64.49,10.22 SW6.1 52.07,13.55 52.07,18.54 v1(49.78,20.83) ; v1(49.78,24.13) 49.78,28.7 48.51,29.97 48.51,31.02 48.52,31.03 U1.17
  Bottom Layer w0.254: v1(49.78,24.13) v1(49.78,20.83)
RST: length 43.1
  Top Layer w0.254: U1.9 28.2,29.09 v1(23.49,24.38) ; C1.2 6.1,11.64 6.1,13.73 7.13,14.77 SW1.4 17.95,14.77 R1.1 21.59,18.41 v1(21.59,20.83)
  Bottom Layer w0.254: v1(21.59,20.83) 21.59,22.48 v1(23.49,24.38)
XTAL1: length 17.7
  Top Layer w0.254: U1.18 51.06,27.49 U2.2 52.16,26.54 54.7,24 56.87,24 X1.1
XTAL2: length 11.1
  Top Layer w0.254: U1.19 53.6,30.99 55,29.59 U3.1 59.09,25.68 X1.2
$1N1280: length 9.9
  Top Layer w0.254: U1.31 32.77,50.66 R2.1
$1N1412: length 5.9
  Top Layer w0.508: BUZ1.1 48.3,65.66 R7.1
$1N2105: length 2.1
  Top Layer w0.254: LED1.1 15.11,64.11 15.12,64.11 R8.2
$1N2106: length 2
  Top Layer w0.254: LED2.1 R9.2
$1N2107: length 2.1
  Top Layer w0.254: R10.2 21.2,63.69 LED3.1
$1N2108: length 2.2
  Top Layer w0.254: 24.14,65.68 24.14,63.67 R11.2
$1N2109: length 2.1
  Top Layer w0.254: R12.2 27.07,63.57 27.07,65.68
$1N2110: length 2.1
  Top Layer w0.254: 29.99,65.68 29.99,63.57 R13.2
$1N2111: length 2.2
  Top Layer w0.254: 32.91,65.68 32.91,63.66 R14.2
$1N2112: length 2.3
  Top Layer w0.254: R15.2 35.83,63.7 LED8.1

## Copper pours and planes (outline as drawn; the poured copper is in the pictures)
GND on Top Layer: -0.13,71.75 67.82,71.75 67.82,-0.13 -0.13,-0.13
GND on Bottom Layer: -0.13,71.75 67.82,71.75 67.82,-0.13 -0.13,-0.13
